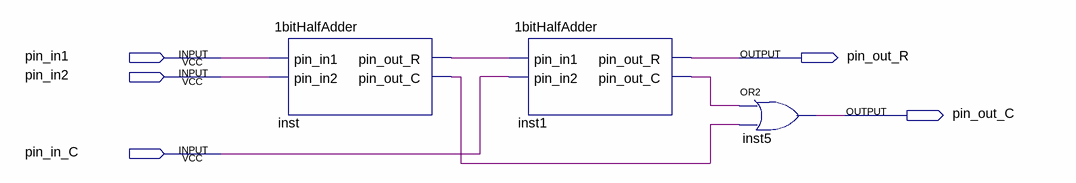
[diagram p0: schematic sheet]
// Quartus schematic 1BitFullAdder.bdf as structural Verilog: 3 symbols, 5 pins
module \1BitFullAdder  (
  input  pin_in1,
  input  pin_in2,
  input  pin_in_C,
  output pin_out_R,
  output pin_out_C
);

  wire inst1_pin_out_c, inst_pin_out_c, inst_pin_out_r;

  \1bitHalfAdder  inst (.pin_in1(pin_in1), .pin_in2(pin_in2), .pin_out_R(inst_pin_out_r), .pin_out_C(inst_pin_out_c));
  \1bitHalfAdder  inst1 (
    .pin_in1(inst_pin_out_r), .pin_in2(pin_in_C), .pin_out_R(pin_out_R), .pin_out_C(inst1_pin_out_c));
  or inst5 (pin_out_C, inst1_pin_out_c, inst_pin_out_c);
endmodule
